# Altium schematic sheet POWER_B2.SchDoc
size A4
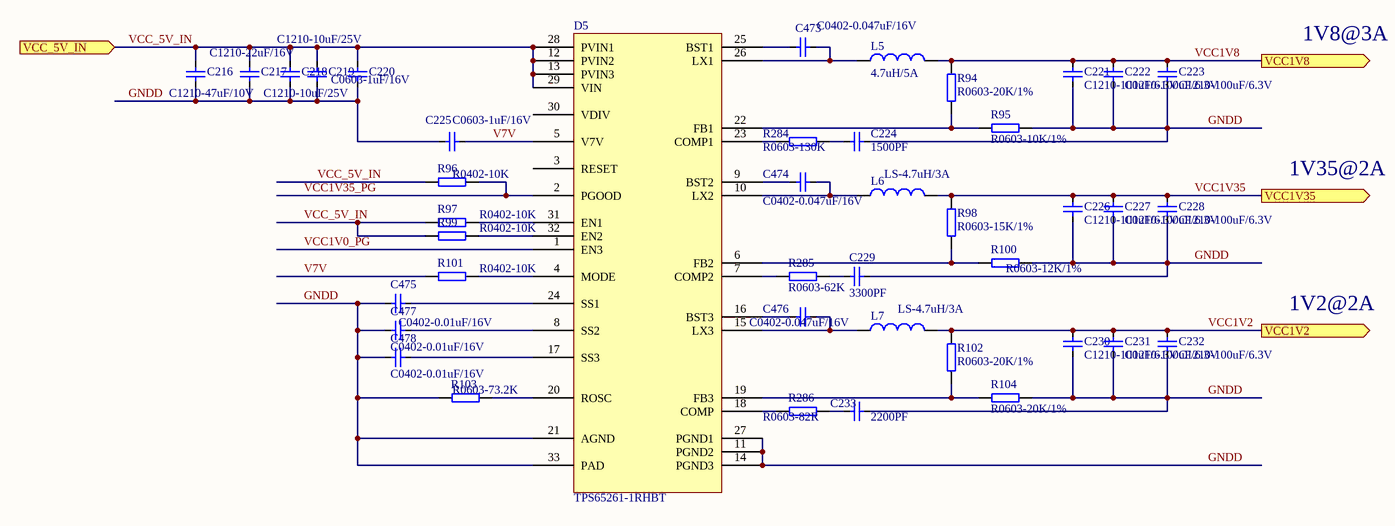
[diagram p0: POWER_B2.SchDoc]

## Parts
C216  C1210-47uF/10V  [C1210]
C217  C1210-22uF/16V  [C1210]
C218  C1210-10uF/25V  [C1210]
C219  C1210-10uF/25V  [C1210]
C220  C0603-1uF/16V  [C0603]
C221  C1210-100uF/6.3V  [C1210]
C222  C1210-100uF/6.3V  [C1210]
C223  C1210-100uF/6.3V  [C1210]
C224  1500PF  [C0603]
C225  C0603-1uF/16V  [C0603]
C226  C1210-100uF/6.3V  [C1210]
C227  C1210-100uF/6.3V  [C1210]
C228  C1210-100uF/6.3V  [C1210]
C229  3300PF  [C0603]
C230  C1210-100uF/6.3V  [C1210]
C231  C1210-100uF/6.3V  [C1210]
C232  C1210-100uF/6.3V  [C1210]
C233  2200PF  [C0603]
C473  C0402-0.047uF/16V  [C0402]
C474  C0402-0.047uF/16V  [C0402]
C475  C0402-0.01uF/16V  [C0402]
C476  C0402-0.047uF/16V  [C0402]
C477  C0402-0.01uF/16V  [C0402]
C478  C0402-0.01uF/16V  [C0402]
D5  TPS65261-1RHBT  [QFN-32N]
L5  4.7uH/5A  [LSMD12-13X13]
L6  LS-4.7uH/3A  [FMJ-0630T]
L7  LS-4.7uH/3A  [FMJ-0630T]
R94  R0603-20K/1%  [R0603]
R95  R0603-10K/1%  [R0603]
R96  R0402-10K  [R0402]
R97  R0402-10K  [R0402]
R98  R0603-15K/1%  [R0603]
R99  R0402-10K  [R0402]
R100  R0603-12K/1%  [R0603]
R101  R0402-10K  [R0402]
R102  R0603-20K/1%  [R0603]
R103  R0603-73.2K  [R0603]
R104  R0603-20K/1%  [R0603]
R284  R0603-130K  [R0603]
R285  R0603-62K  [R0603]
R286  R0603-82R  [R0603]

## Ports
VCC1V2 (out), VCC1V8 (out), VCC1V35 (out), VCC_5V_IN (in)

## Nets
GNDD: C216.2 C217.2 C218.2 C219.2 C220.2 C221.2 C222.2 C223.2 C224.2 C225.1 C226.2 C227.2 C228.2 C229.2 C230.2 C231.2 C232.2 C233.2 C475.1 C477.1 C478.1 D5.11(PGND2) D5.14(PGND3) D5.21(AGND) D5.27(PGND1) D5.33(PAD) R95.2 R100.2 R103.1 R104.2
V7V: C225.2 D5.5(V7V) R101.1
VCC1V0_PG: D5.1(EN3)
VCC1V2: C230.1 C231.1 C232.1 L7.2 R102.2 ; port VCC1V2
VCC1V8: C221.1 C222.1 C223.1 L5.2 R94.2 ; port VCC1V8
VCC1V35: C226.1 C227.1 C228.1 L6.2 R98.2 ; port VCC1V35
VCC1V35_PG: D5.2(PGOOD) R96.2
VCC_5V_IN: C216.1 C217.1 C218.1 C219.1 C220.1 D5.12(PVIN2) D5.13(PVIN3) D5.28(PVIN1) D5.29(VIN) R96.1 R97.1 R99.1 ; port VCC_5V_IN
NetC224_1: C224.1 R284.2
NetC229_1: C229.1 R285.2
NetC233_1: C233.1 R286.2
NetC473_1: C473.1 D5.25(BST1)
NetC473_2: C473.2 D5.26(LX1) L5.1
NetC474_1: C474.1 D5.9(BST2)
NetC474_2: C474.2 D5.10(LX2) L6.1
NetC475_2: C475.2 D5.24(SS1)
NetC476_1: C476.1 D5.16(BST3)
NetC476_2: C476.2 D5.15(LX3) L7.1
NetC477_2: C477.2 D5.8(SS2)
NetC478_2: C478.2 D5.17(SS3)
NetD5_4: D5.4(MODE) R101.2
NetD5_6: D5.6(FB2) R98.1 R100.1
NetD5_7: D5.7(COMP2) R285.1
NetD5_18: D5.18(COMP) R286.1
NetD5_19: D5.19(FB3) R102.1 R104.1
NetD5_20: D5.20(ROSC) R103.2
NetD5_22: D5.22(FB1) R94.1 R95.1
NetD5_23: D5.23(COMP1) R284.1
NetD5_31: D5.31(EN1) R97.2
NetD5_32: D5.32(EN2) R99.2

Not connected (* = marked no-connect by the designer): D5 3(RESET) 30(VDIV)

## Notes on the sheet
- 1V8@3A
- 1V35@2A
- 1V2@2A

## Library data of the parts
C216 C218 C219 C221-C223 C226-C228 C230-C232 = C1210-22uF/16V: Part_type: CAP; Schematic_Part: CAP; PCB_Footprint: C1210
  C216: Part_number: C1210-47uF/10V; Value: C1210-47uF/10V
  C218 C219: Part_number: C1210-10uF/25V; Value: C1210-10uF/25V
  C221-C223 C226-C228 C230-C232: Part_number: C1210-100uF/6.3V; Value: C1210-100uF/6.3V
C220 C225 = C0603-100nF/16V: X7R; Part_number: C0603-1uF/16V; Part_type: CAP; Value: C0603-1uF/16V; temperature: -55℃\+125℃; Schematic_Part: CAP; PCB_Footprint: C0603
C224 C229 C233 = C1210-22uF/16V: PCB_Footprint: C1210; Part_type: CAP; Schematic_Part: CAP
  C224: Part_number: 1500PF; Value: 1500PF
  C229: Part_number: 3300PF; Value: 3300PF
  C233: Part_number: 2200PF; Value: 2200PF
C473-C478 = C0402-0.1uF/16V: X7R; Manufacturer: SAMSUNG; Manufacturer_p/n: CL05X7R104KO5NNN; Part_type: CAP; temperature: -55℃\+125℃; Schematic_Part: CAP; PCB_Footprint: C0402; datasheet: #DataSheet\C_Samsung_General Capacitors.pdf#
  C473 C474 C476: Part_number: C0402-0.047uF/16V; Value: C0402-0.047uF/16V
  C475 C477 C478: Part_number: C0402-0.01uF/16V; Value: C0402-0.01uF/16V
D5 = TPS65261RHBT: Part_number: TPS65261-1RHBT
L5 = LS-6.8uH/5A: Part_number: 4.7uH/5A; Part_type: INDUCTOR; Value1: 6.8uH/5A; Schematic_Part: INDUCTOR; PCB_Footprint: LSMD12-13X13
L6 L7 = LS-4.7uH/5.5A: 7.3*6.6*3mm,4.7uH/5.5A,40mR,20%,TMP; Manufacturer_p/n: FMJ-0630T-4R7 HF; Part_number: LS-4.7uH/3A; Part_type: INDUCTOR; temperature: -55℃\+125℃; Value1: 4.7uH/3A; Schematic_Part: INDUCTOR; PCB_Footprint: FMJ-0630T; Manufacturer: TMP; datasheet: #DataSheet\IND_TMP_FMJ-0630T.pdf#
R94 R95 R98 R100 R103 R284-R286 = R0603-0R: Manufacturer: HKT; Manufacturer_p/n: RI0603L000JT; Part_type: RES; Schematic_Part: RES; PCB_Footprint: R0603; Manufacturer_p/n2: SAMSUNG
  R94: Part_number: R0603-20K/1%; Value: R0603-20K/1%
  R95: Part_number: R0603-10K/1%; Value: R0603-10K/1%
  R98: Part_number: R0603-15K/1%; Value: R0603-15K/1%
  R100: Part_number: R0603-12K/1%; Value: R0603-12K/1%
  R103: Part_number: R0603-73.2K; Value: R0603-73.2K
  R284: Part_number: R0603-130K; Value: R0603-130K
  R285: Part_number: R0603-62K; Value: R0603-62K
  R286: Part_number: R0603-82R; Value: R0603-82R
R96 R97 R99 R101 = R0402-10K: Manufacturer: SAMSUNG; Part_number: R0402-10K; Part_type: RES; Value: R0402-10K; Schematic_Part: RES; PCB_Footprint: R0402
R102 = R0603-0R: Manufacturer: HKT; Manufacturer_p/n: RI0603L000JT; Value: R0603-10K/1%; Part_number: R0603-20K/1%; Part_type: RES; Schematic_Part: RES; PCB_Footprint: R0603; Manufacturer_p/n2: SAMSUNG
R104 = R0603-0R: Manufacturer: HKT; Manufacturer_p/n: RI0603L000JT; Value: R0603-12K/1%; Part_number: R0603-20K/1%; Part_type: RES; Schematic_Part: RES; PCB_Footprint: R0603; Manufacturer_p/n2: SAMSUNG
C217 = C1210-22uF/16V: Part_number: C1210-22uF/16V; Part_type: CAP; Value: C1210-22uF/16V; Schematic_Part: CAP; PCB_Footprint: C1210